# Altium schematic sheet Unidirectional_lvlshifter.SchDoc
size A
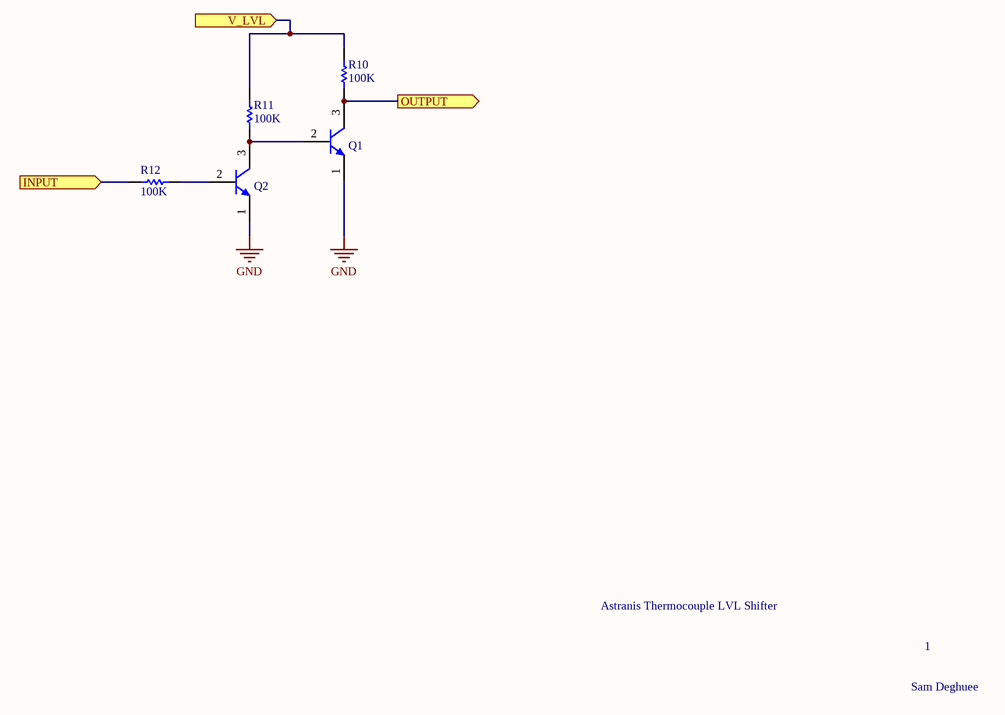
[diagram p0: Unidirectional_lvlshifter.SchDoc]

## Parts
Q1  MPSA18G  [ONSC-TO-92-3-29-11]  (value not drawn)
Q2  MPSA18G  [ONSC-TO-92-3-29-11]  (value not drawn)
R10  value 100K  [RESC0603(1608)_L]  (hidden comment: RES0603)
R11  value 100K  [RESC0603(1608)_L]  (hidden comment: RES0603)
R12  value 100K  [RESC0603(1608)_L]  (hidden comment: RES0603)

## Ports
INPUT (in), OUTPUT (out), V_LVL (in)

## Nets
GND: Q1.1(E) Q2.1(E)
INPUT: R12.1 ; port INPUT
OUTPUT: Q1.3(C) R10.2 ; port OUTPUT
V_LVL: R10.1 R11.1 ; port V_LVL
NetQ1_2: Q1.2(B) Q2.3(C) R11.2
NetQ2_2: Q2.2(B) R12.2

## Notes on the sheet
- Astranis Thermocouple LVL Shifter
- 1
- Sam Deghuee

## Library data of the parts
Q1 Q2 = CMP-1048-01396-1: Low Noise Transistor, NPN Silicon, 3-Pin TO-92, Pb-Free, Bulk Box; Manufacturer: On Semiconductor; IC Continuous (A): 0.2; fT Min (MHz): 100; PackageDescription: 3-Pin Transistor Outline, Body 4.825 x 3.685 mm, Pitch 1.27 mm; ComponentLink2URL: http://www.onsemi.cn/pub_link/Collateral/MPSA18-D.PDF; PackageVersion: Rev. AM; DatasheetVersion: Rev. 4; ComponentLink3URL: http://www.onsemi.cn/pub_link/Collateral/2N6426-D.PDF; Packing: Bulk Box; ComponentLink3Description: Package Specification; Polarity: NPN; RoHS: TRUE; ComponentLink2Description: Datasheet; ComponentLink1Description: Manufacturer URL; ComponentLink1URL: http://www.onsemi.com/; PartNumber: MPSA18G; Mounting Technology: Through Hole; PackageReference: TO-92-3-29-11_AM_SL
R10-R12 = CMP-1591-00001-1: 0603 (1608 Metric) Chip Resistor; Case-Metric: 1608; Case-EIA: 0603; PackageReference: RESC0603(1608)